# Altium schematic sheet Current_SenseSchematic.SchDoc (part 3 of 3)
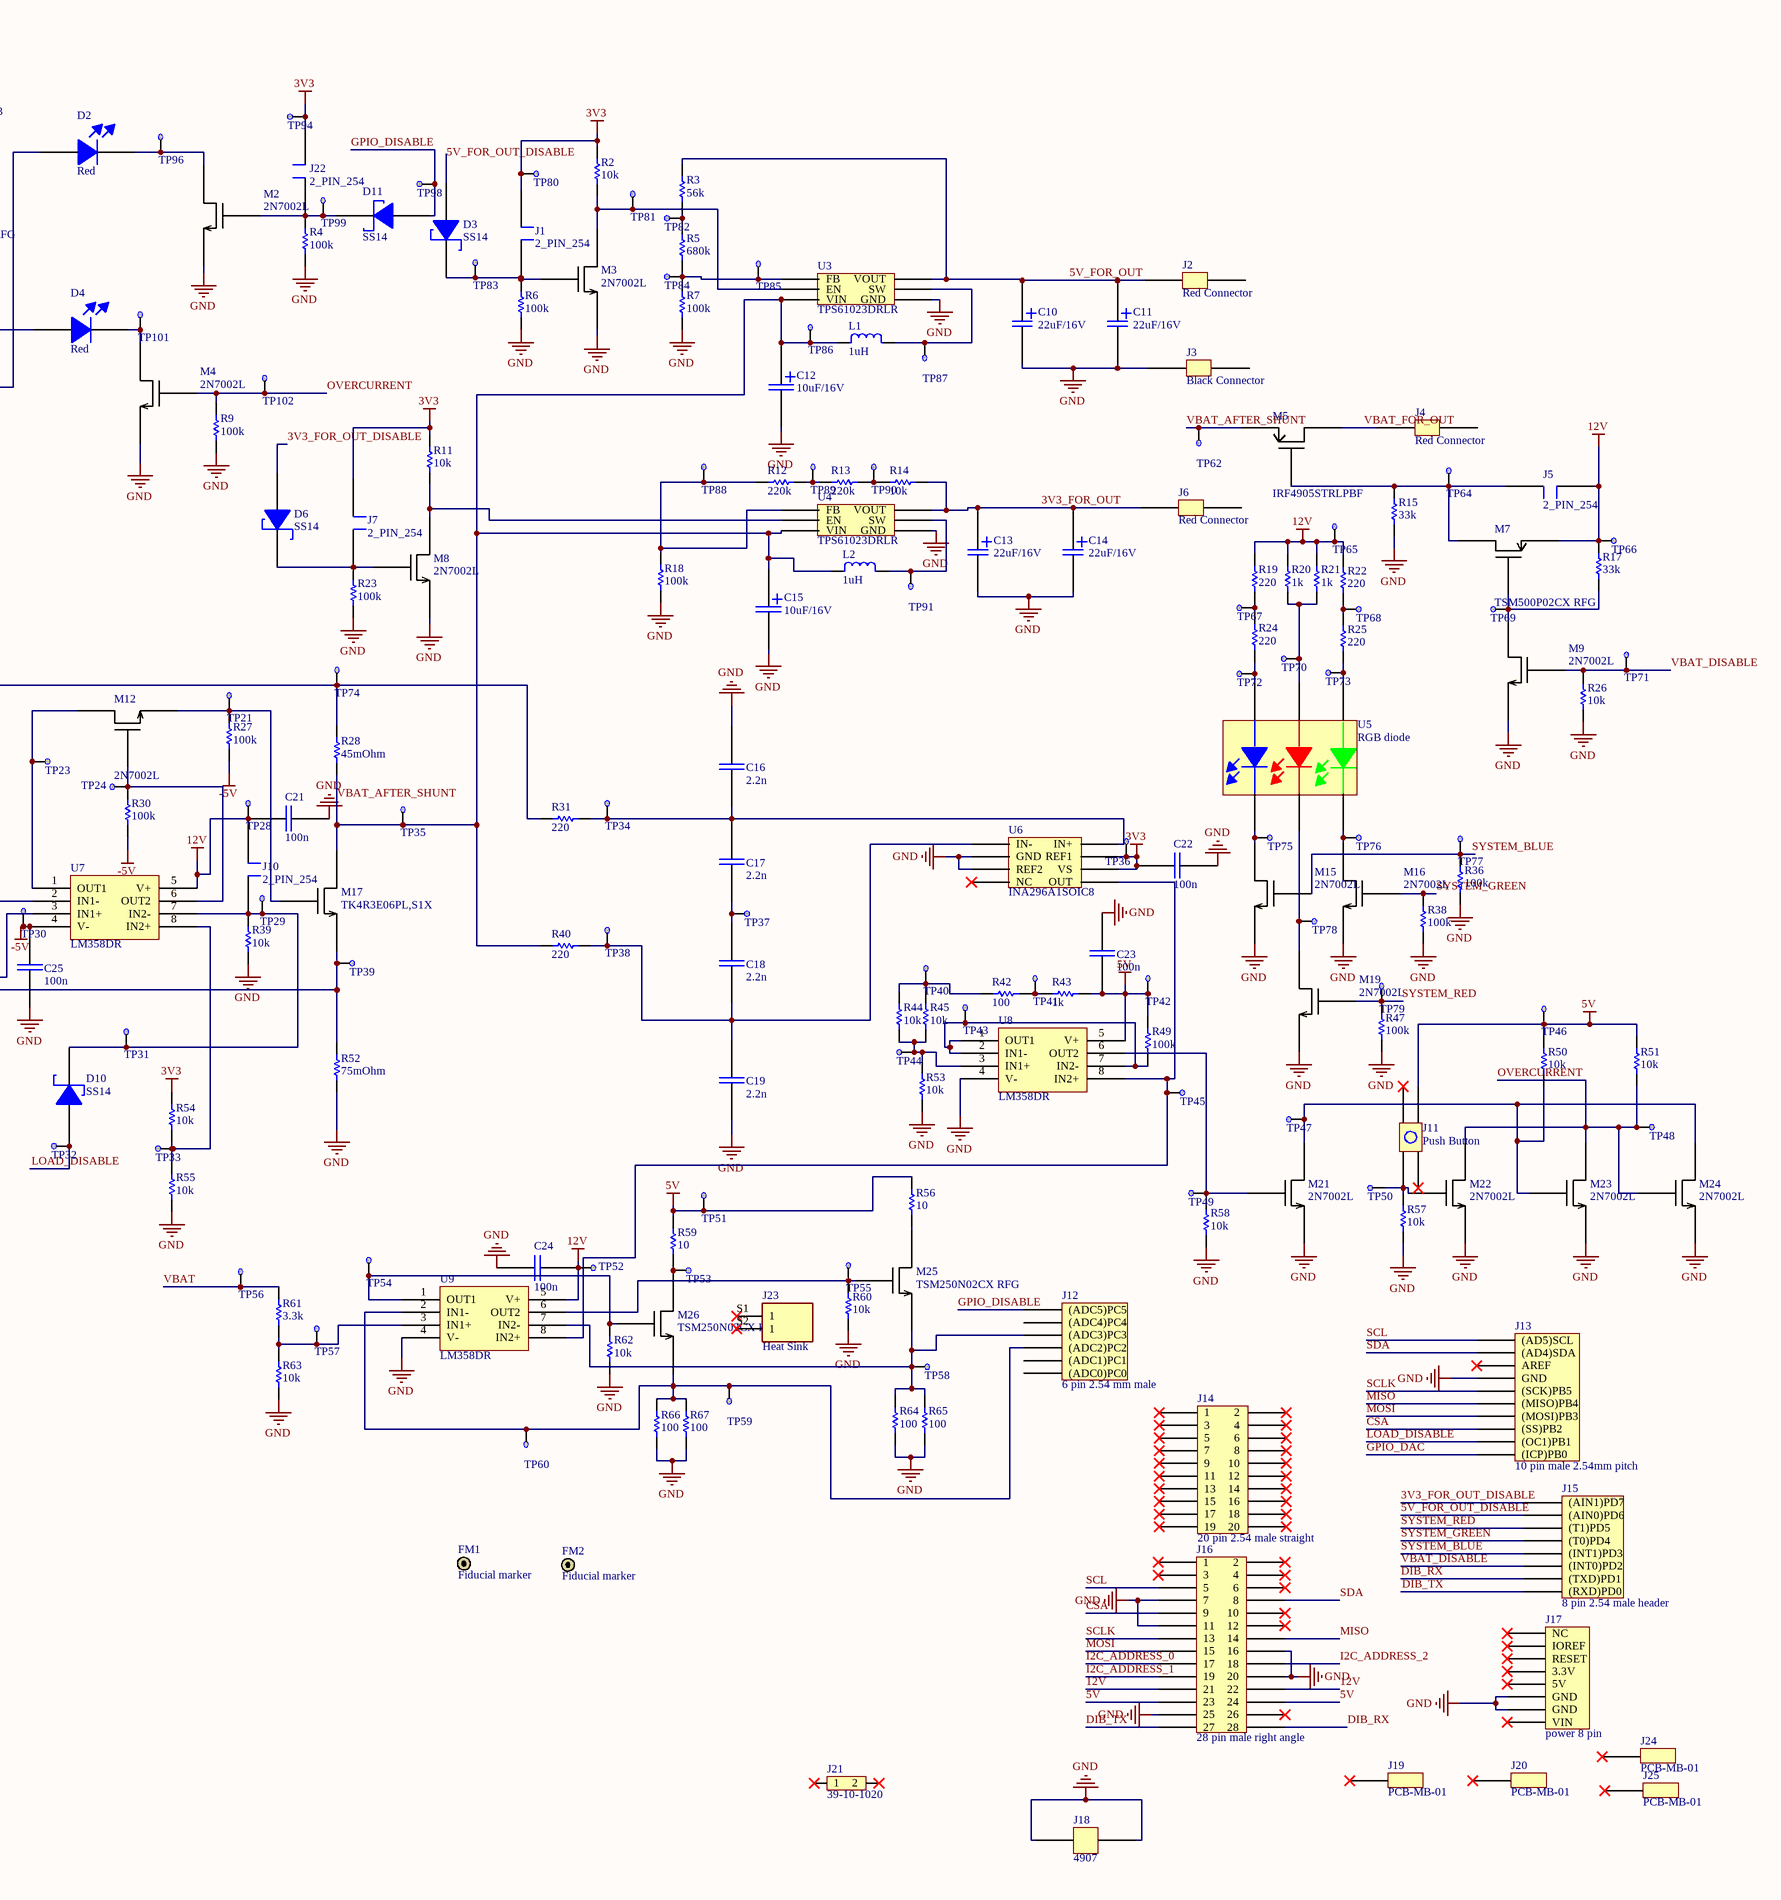
[diagram p3: Current_SenseSchematic.SchDoc, right]

## Library data of the parts (continued)
R61 = CR1206-FX-3301ELF: Res Thick Film 1206 3.3K Ohm 1% 1/4W ±100ppm/°C Molded SMD SMD Paper Tape on Plastic Reel; Manufacturer: Bourns; Supplier: Farnell; Supplier Part Number: 2333568; Manufacturer Part Number: CR1206-FX-3301ELF; RoHS: Yes; Category: Chip SMD Resistors; Stock: 16725; Pricing: 10=0.015, 100=0.013, 500=0.011, 1000=0.01, 2500=0.009, 5000=0.008, 25000=0.0078, 50000=0.0077 (GBP); ComponentLink1URL: https://datasheet.ciiva.com/41449/001055537-da-01-en-smd-wid-cr1206-fx-3301elf-3-3k-ohm-1-4w-41449983.pdf?src-supplier=Conrad; ComponentLink1Description: https://datasheet.ciiva.com/41449/001055537-da-01-en-smd-wid-cr1206-fx-3301elf-3-3k-ohm-1-4w-41449983.pdf?src-supplier=Conrad; ComponentLink2URL: https://datasheet.ciiva.com/9123/chpreztr-9123018.pdf?src-supplier=Avnet; ComponentLink2Description: https://datasheet.ciiva.com/9123/chpreztr-9123018.pdf?src-supplier=Avnet; ComponentLink3URL: https://datasheet.ciiva.com/7986/1902866-7986219.pdf?src-supplier=Element14; ComponentLink3Description: https://datasheet.ciiva.com/7986/1902866-7986219.pdf?src-supplier=Element14; ComponentLink4URL: https://datasheet.ciiva.com/6547/chpreztr-6547480.pdf?src-supplier=Digikey; ComponentLink4Description: https://datasheet.ciiva.com/6547/chpreztr-6547480.pdf?src-supplier=Digikey; ComponentLink5URL: https://datasheet.ciiva.com/6547/chpreztr-6547484.pdf?src-supplier=Digikey; ComponentLink5Description: https://datasheet.ciiva.com/6547/chpreztr-6547484.pdf?src-supplier=Digikey
U1 = LM3940IMP-3.3/NOPB: IC REG LDO 3.3V 1A SOT223; Manufacturer: TI National Semiconductor; Supplier: Mouser; Supplier Part Number: 926-LM3940IMP3.3NOPB; Manufacturer Part Number: LM3940IMP-3.3/NOPB; RoHS: Yes; Category: Voltage Regulators - Linear; Stock: 56777
U2 = TPS60400DBVT: 60mA Charge Pump Voltage Inverter with Variable Switching Frequency 5-SOT-23 -40 to 85; Manufacturer: Texas Instruments; Supplier: Farnell; Supplier Part Number: 3123047; RoHS: No; Category: Voltage Regulators - Switching; Stock: 2; Pricing: 1=1.22, 10=0.692, 250=0.649, 500=0.605, 1000=0.593, 2500=0.58, 5000=0.568 (GBP); ComponentLink1URL: https://datasheet.ciiva.com/15114/getdatasheetpartid-256453-15114097.pdf?src-supplier=Verical; ComponentLink1Description: https://datasheet.ciiva.com/15114/getdatasheetpartid-256453-15114097.pdf?src-supplier=Verical; ComponentLink2URL: https://datasheet.ciiva.com/27049/763104-27049859.pdf?src-supplier=Jameco; ComponentLink2Description: https://datasheet.ciiva.com/27049/763104-27049859.pdf?src-supplier=Jameco; ComponentLink3URL: https://datasheet.ciiva.com/3215/tps60403-3215749.pdf?src-supplier=Avnet; ComponentLink3Description: https://datasheet.ciiva.com/3215/tps60403-3215749.pdf?src-supplier=Avnet; ComponentLink4URL: https://datasheet.ciiva.com/2025/tps60400-2025353.pdf?src-supplier=Digi-Key; ComponentLink4Description: https://datasheet.ciiva.com/2025/tps60400-2025353.pdf?src-supplier=Digi-Key; ComponentLink5URL: https://datasheet.ciiva.com/2025/tps60400-2025354.pdf?src-supplier=Digi-Key; ComponentLink5Description: https://datasheet.ciiva.com/2025/tps60400-2025354.pdf?src-supplier=Digi-Key; ComponentLink6URL: https://datasheet.ciiva.com/2025/tps60400-2025355.pdf?src-supplier=Digi-Key; ComponentLink6Description: https://datasheet.ciiva.com/2025/tps60400-2025355.pdf?src-supplier=Digi-Key; ComponentLink7URL: https://datasheet.ciiva.com/7993/1882771-7993918.pdf?src-supplier=Element14; ComponentLink7Description: https://datasheet.ciiva.com/7993/1882771-7993918.pdf?src-supplier=Element14; ComponentLink8URL: https://datasheet.ciiva.com/46397/1882771-46397626.pdf?src-supplier=Element14; ComponentLink8Description: https://datasheet.ciiva.com/46397/1882771-46397626.pdf?src-supplier=Element14; ComponentLink9URL: https://datasheet.ciiva.com/46433/tps60400-46433678.pdf?src-supplier=Element14; ComponentLink9Description: https://datasheet.ciiva.com/46433/tps60400-46433678.pdf?src-supplier=Element14; Manufacturer Part Number: TPS60400DBVT
U3 U4 = TPS61023DRLR: 3.7-A boost converter with 0.5-V ultra-low input voltage 6-SOT-5X3 -40 to 125; Manufacturer: Texas Instruments; Supplier: Mouser; Supplier Part Number: 595-TPS61023DRLR; Manufacturer Part Number: TPS61023DRLR; RoHS: Yes; Category: Voltage Regulators - Switching; Stock: 26228; ComponentLink1URL: http://www.ti.com/general/docs/suppproductinfo.tsp?distId=10&amp;gotoUrl=http%3A%2F%2Fwww.ti.com%2Flit%2Fgpn%2Ftps61023&src-supplier=Digikey; ComponentLink1Description: http://www.ti.com/general/docs/suppproductinfo.tsp?distId=10&amp;gotoUrl=http%3A%2F%2Fwww.ti.com%2Flit%2Fgpn%2Ftps61023&src-supplier=Digikey
U5 = 150352M173300: WL-SFTW SMT full-color TOP LED waterclear; Manufacturer: Wurth Electronics; Lens Color: Colorless; Lens Style: Flat,Square; Lens Transparency: Clear; Luminous Intensity: 400mcd; Forward Voltage: 3.2V; Viewing Angle: 120°; Dominant Wavelength: 470nm; Lens Size: 2.44mm; Supplier: Farnell; Supplier Part Number: 2900778; Manufacturer Part Number: 150352M173300; RoHS: No; Category: LEDs; Stock: 2024; Pricing: 1=0.635, 10=0.556, 25=0.516, 50=0.485, 100=0.454, 500=0.404 (GBP); Mounting Technology: Surface Mount; Case/Package: PLCC; Pins: 6; Color: Blue,Green,Red; Packaging: Cut Tape; Series: WL-SFTW; Length: 3.2mm; Width: 2.8mm; Height: 1.85mm; RoHS Compliant: No; ComponentLink1URL: http://www.farnell.com/datasheets/2621660.pdf?src-supplier=Farnell; ComponentLink1Description: http://www.farnell.com/datasheets/2621660.pdf?src-supplier=Farnell; ComponentLink2URL: https://katalog.we-online.de/pbs/datasheet/150352M173300.pdf?src-supplier=Digikey; ComponentLink2Description: https://katalog.we-online.de/pbs/datasheet/150352M173300.pdf?src-supplier=Digikey; ComponentLink3URL: http://www.farnell.com/datasheets/2621660.pdf?src-supplier=Element14; ComponentLink3Description: http://www.farnell.com/datasheets/2621660.pdf?src-supplier=Element14; ComponentLink4URL: http://www.farnell.com/datasheets/2621660.pdf?src-supplier=Newark; ComponentLink4Description: http://www.farnell.com/datasheets/2621660.pdf?src-supplier=Newark
U6 = INA296A1IDDFR: Operational Amplifier, 1 Func, 150uV Offset-Max, PDSO5; Manufacturer: Texas Instruments; Supplier: Digikey; Supplier Part Number: 296-INA296A1IDDFRCT-ND; Manufacturer Part Number: INA296A1IDDFR; RoHS: No; Category: Amplifiers - Op Amps, Buffer, Instrumentation; Stock: 525; Supplier 1: Digikey; Supplier Part Number 1: 296-INA296A1IDDFRCT-ND
U7-U9 = LM358DR: Operational Amplifier, Dual, 700 Khz, 2, 0.3 V/ S, 3V To 32V, 1.5V To 16V, Soic, 8 Rohs Compliant: Yes; Manufacturer: Texas Instruments; Gain Bandwidth Product: 700kHz; Number of Channels: 2; Common Mode Rejection Ratio: 65dB; Voltage Gain: 100dB; Slew Rate: 0.3V/µs; Input Bias Current: 250nA; Amplifier Type: GENERAL PURPOSE; Output Current: 30mA; Input Offset Voltage (Vos): 7mV; Operating Supply Current: 1mA; Supply Current: 1.2mA; Supplier: Mouser; Supplier Part Number: 595-LM358DR; RoHS: Yes; Category: Amplifiers - Op Amps, Buffer, Instrumentation; Stock: 179857; Mounting Technology: Surface Mount; Case/Package: SOIC; Pins: 8; Min Operating Temperature: 0°C; Max Operating Temperature: 70°C; Packaging: Tape and Reel; Min Supply Voltage: 3V; Min Dual Supply Voltage: 1.5V; Max Dual Supply Voltage: 16V; Number of Circuits: 2; Max Supply Voltage: 32V; Operating Supply Voltage: 16V; Package Quantity: 2500; Series: -; Technology: BIPOLAR; Bandwidth: 700kHz; Output Current per Channel: 30mA; Number of Elements: 2; Number of Amplifiers: 2; Unity Gain Bandwidth Product: 700kHz; Thickness: 1.58mm; Radiation Hardening: No; RoHS Compliant: Yes; Lead Free: Lead Free; Reach SVHC Compliant: No; ComponentLink1URL: https://datasheet.ciiva.com/1795/lm358-1795488.pdf?src-supplier=Digi-Key; ComponentLink1Description: https://datasheet.ciiva.com/1795/lm358-1795488.pdf?src-supplier=Digi-Key; ComponentLink2URL: https://datasheet.ciiva.com/27056/2016330-27056228.pdf?src-supplier=Jameco; ComponentLink2Description: https://datasheet.ciiva.com/27056/2016330-27056228.pdf?src-supplier=Jameco; ComponentLink3URL: https://datasheet.ciiva.com/7709/1874566-7709823.pdf?src-supplier=Element14; ComponentLink3Description: https://datasheet.ciiva.com/7709/1874566-7709823.pdf?src-supplier=Element14; ComponentLink4URL: https://datasheet.ciiva.com/46385/1874566-46385851.pdf?src-supplier=Element14; ComponentLink4Description: https://datasheet.ciiva.com/46385/1874566-46385851.pdf?src-supplier=Element14; ComponentLink5URL: https://datasheet.ciiva.com/46390/1874566-46390414.pdf?src-supplier=Element14; ComponentLink5Description: https://datasheet.ciiva.com/46390/1874566-46390414.pdf?src-supplier=Element14; ComponentLink6URL: https://datasheet.ciiva.com/1795/lm358-1795487.pdf?src-supplier=Digi-Key; ComponentLink6Description: https://datasheet.ciiva.com/1795/lm358-1795487.pdf?src-supplier=Digi-Key; ComponentLink7URL: https://datasheet.ciiva.com/1795/lm358-1795489.pdf?src-supplier=Digi-Key; ComponentLink7Description: https://datasheet.ciiva.com/1795/lm358-1795489.pdf?src-supplier=Digi-Key; ComponentLink8URL: https://datasheet.ciiva.com/2973/lm358a-2973386.pdf?src-supplier=Avnet; ComponentLink8Description: https://datasheet.ciiva.com/2973/lm358a-2973386.pdf?src-supplier=Avnet; Manufacturer Part Number: LM358DR
U10 = M24C32-WMN6P: M24C32 Series 32 Kb (4 K x 8) 2.5 V SMT Serial I²C Bus EEPROM - SOIC-8; Manufacturer: STMicroelectronics; Supplier: Mouser; Supplier Part Number: 511-M24C32-WMN6P; Manufacturer Part Number: M24C32-WMN6P; RoHS: Yes; Category: EEPROM; Stock: 15207; Pricing: 1=0.24, 10=0.213, 50=0.213, 100=0.18, 1000=0.18, 10000=0.153 (USD); ComponentLink1URL: https://datasheet.ciiva.com/34303/1996428-34303716.pdf?src-supplier=Jameco; ComponentLink1Description: https://datasheet.ciiva.com/34303/1996428-34303716.pdf?src-supplier=Jameco; ComponentLink2URL: https://datasheet.ciiva.com/15123/getdatasheetpartid-131488-15123216.pdf?src-supplier=Verical; ComponentLink2Description: https://datasheet.ciiva.com/15123/getdatasheetpartid-131488-15123216.pdf?src-supplier=Verical; ComponentLink3URL: https://datasheet.ciiva.com/1908/cd00001012-1908030.pdf?src-supplier=Digikey; ComponentLink3Description: https://datasheet.ciiva.com/1908/cd00001012-1908030.pdf?src-supplier=Digikey; ComponentLink4URL: https://datasheet.ciiva.com/1908/cd00001012-1908031.pdf?src-supplier=Digikey; ComponentLink4Description: https://datasheet.ciiva.com/1908/cd00001012-1908031.pdf?src-supplier=Digikey; ComponentLink5URL: https://datasheet.ciiva.com/3185/cd00001012-3185149.pdf?src-supplier=Avnet; ComponentLink5Description: https://datasheet.ciiva.com/3185/cd00001012-3185149.pdf?src-supplier=Avnet; ComponentLink6URL: https://datasheet.ciiva.com/8055/1673526-8055165.pdf?src-supplier=Element14; ComponentLink6Description: https://datasheet.ciiva.com/8055/1673526-8055165.pdf?src-supplier=Element14; Supplier 1: Mouser; Supplier Part Number 1: 511-M24C32-WMN6P